# EasyEDA schematic SCH_Potentiometer_Led_MCP3008_2025-04-22.json
TITLE: Sheet_1; REV: 1.0; Date: 2025-04-22; Sheet: 1/1; Drawn By: dgasparyan073; Company: Your Company
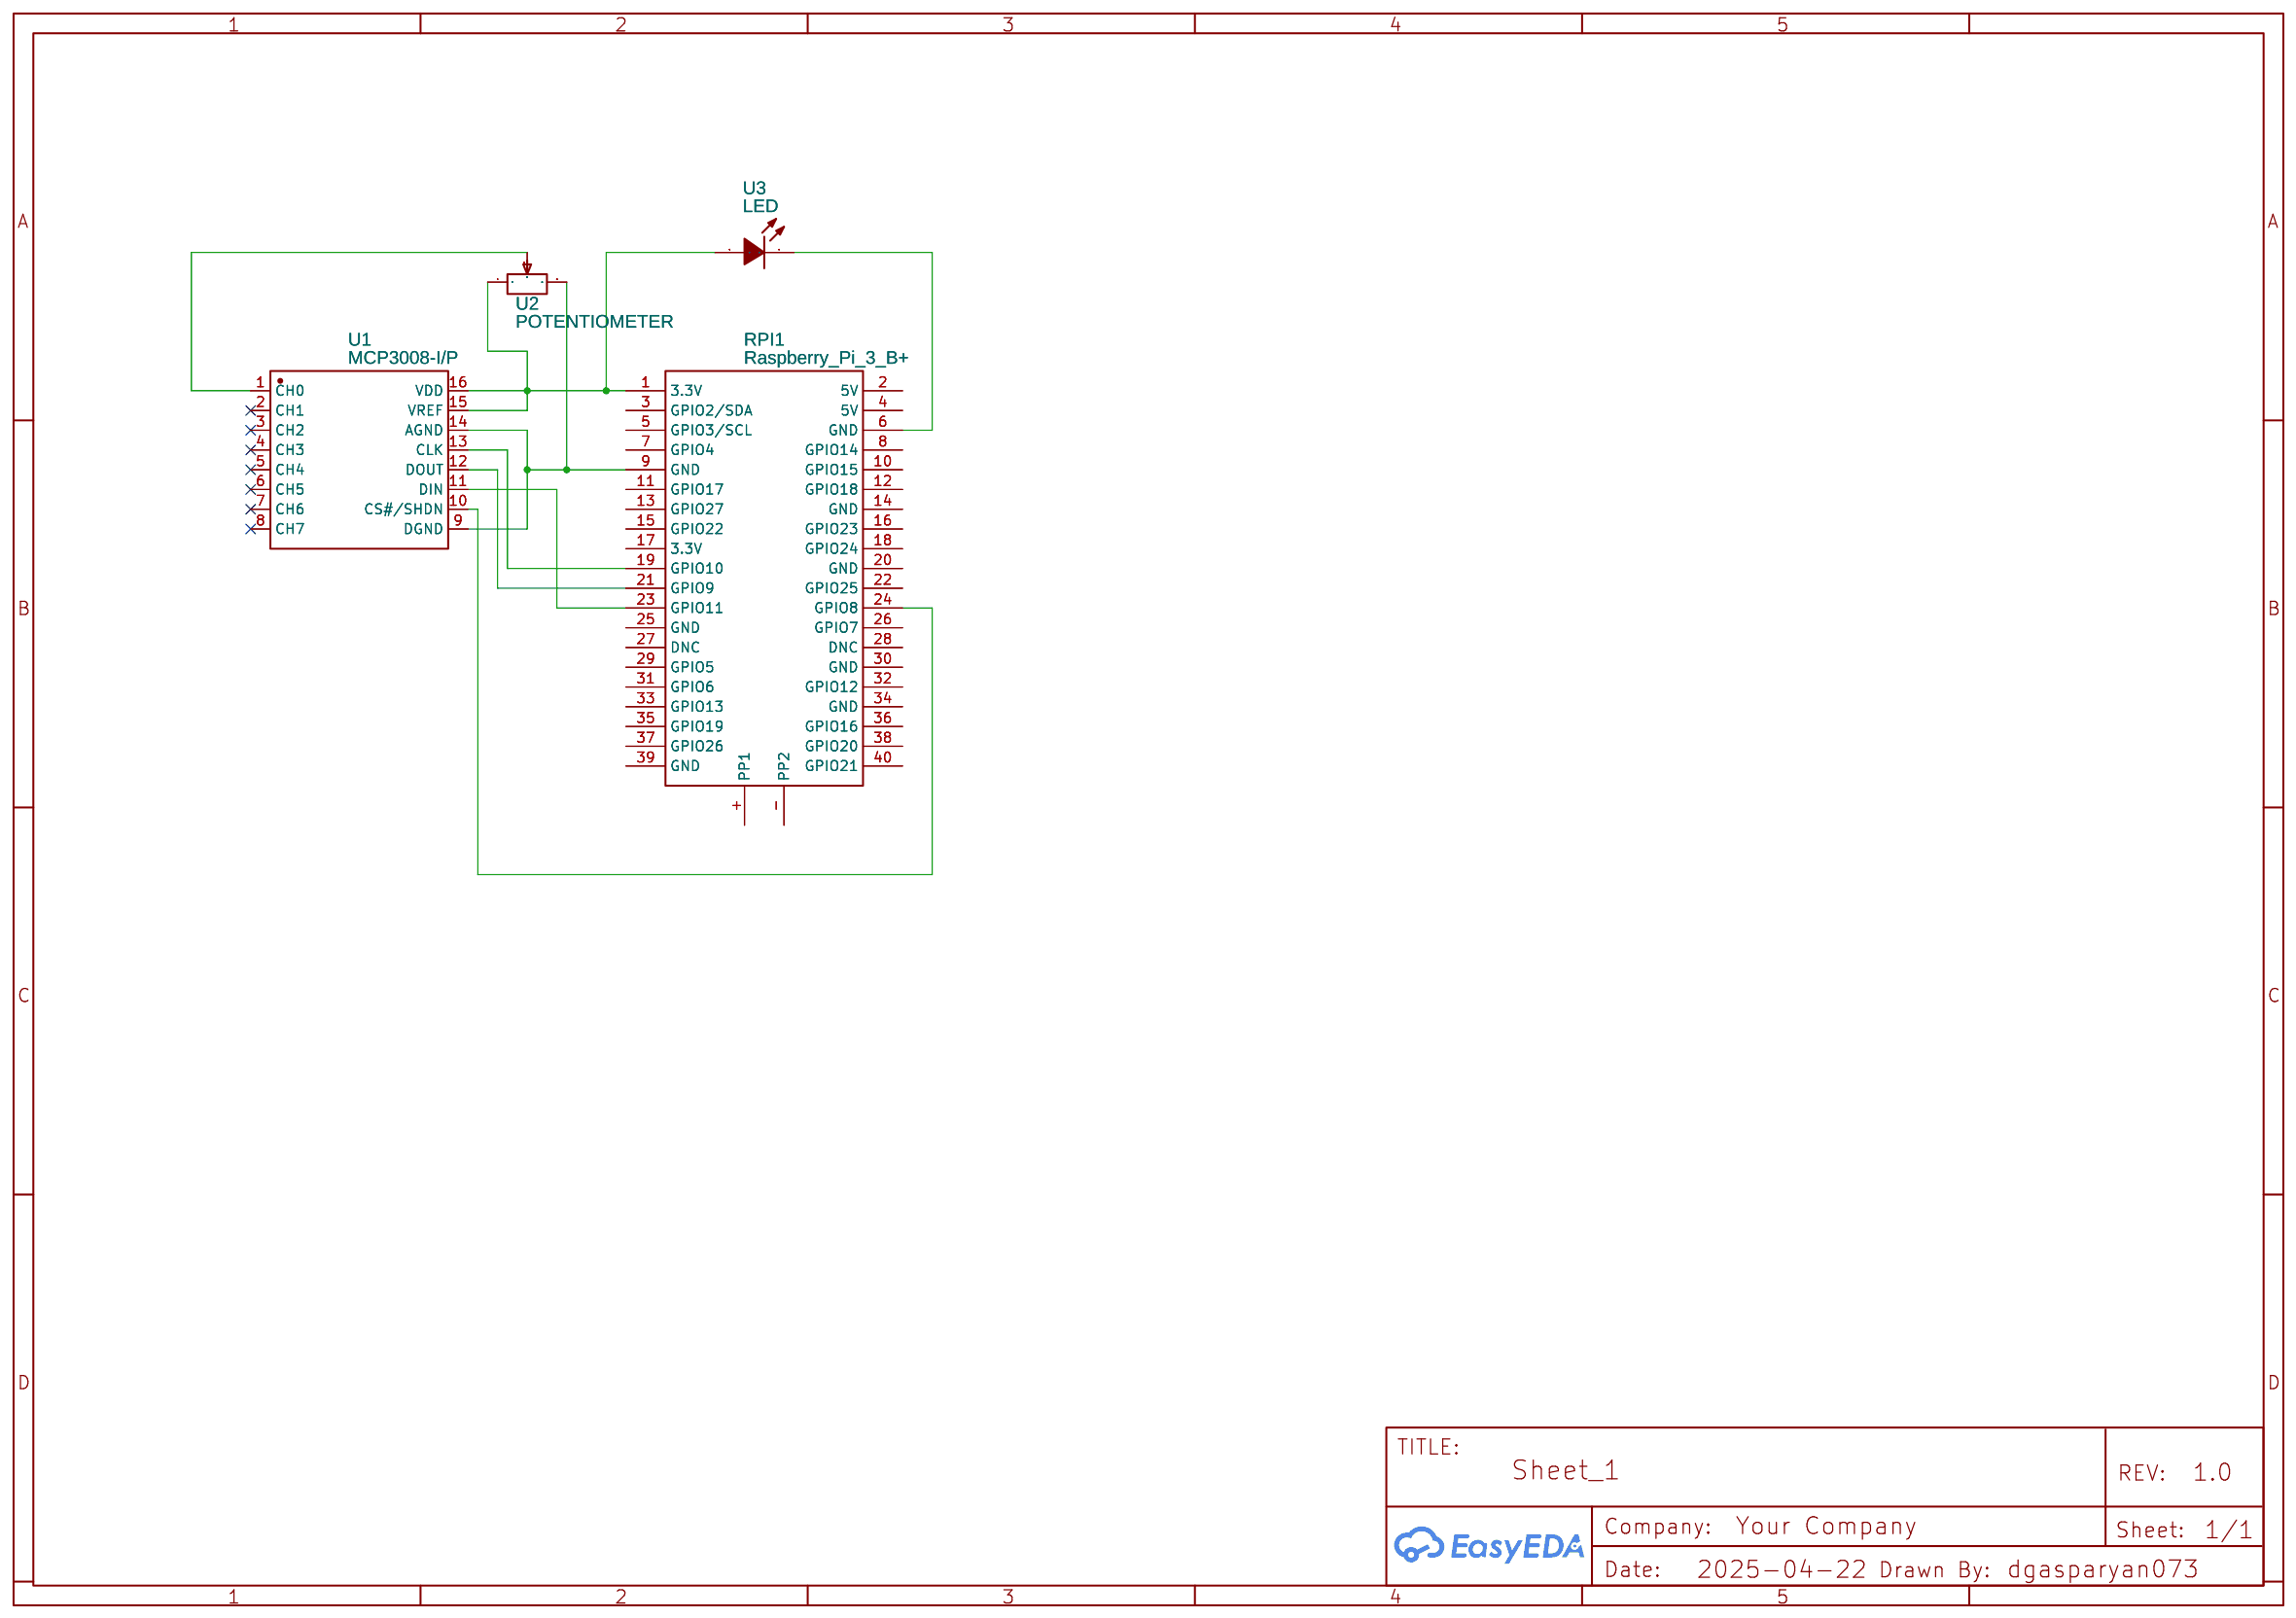
[diagram p0: schematic sheet]

## Parts
RPI1  Raspberry_Pi_3_B+  [HDR-20X2/2.54]
U1  MCP3008-I/P  [PDIP-16_L19.3-W6.5-P2.54-LS7.6-BL]
U2  POTENTIOMETER  [RES-ADJ-SMD_VG039NCH]
U3  LED  [LED-SMD_SD65-120-LED]

## Library data of the parts
RPI1 = Raspberry_Pi_3_B+: Contributor: Christopher; Supplier: Adafruit; Manufacturer: Raspberry Pi; Supplier Part: 3775; Manufacturer Part: Raspberry Pi 3 - Model B+ - 1.4GHz Cortex-A53 with 1GB RAM
U1 = MCP3008-I/P: Contributor: LCSC; Supplier: LCSC; Supplier Part: C2890491; Manufacturer: MICROCHIP(美国微芯); JLCPCB Part Class: Extended Part
U2 = 3*3POTENTIOMETER-10KΩ20%: Contributor: LCSC; Supplier: LCSC; Supplier Part: C9900010776; Manufacturer: null; Manufacturer Part: 3*3Potentiometer-10kΩ20%; JLCPCB Part Class: Extended Part
U3 = 720-LCGH9RNMXNX1: Contributor: lcsc; Supplier: LCSC; Supplier Part: C9900019959; Manufacturer: null; JLCPCB Part Class: Extended Part

## Nets
Net-(RPI1-1): RPI1.1(3.3V) U1.15(VREF) U1.16(VDD) U2.1 U3.2(A)
Net-(RPI1-6): RPI1.6(GND) U3.1(K)
Net-(RPI1-9): RPI1.9(GND) U1.9(DGND) U1.14(AGND) U2.3
Net-(RPI1-19): RPI1.19(GPIO10) U1.13(CLK)
Net-(RPI1-21): RPI1.21(GPIO9) U1.12(DOUT)
Net-(RPI1-23): RPI1.23(GPIO11) U1.11(DIN)
Net-(RPI1-24): RPI1.24(GPIO8) U1.10(CS#/SHDN)
Net-(U1-1): U1.1(CH0) U2.2

Not connected (* = marked no-connect by the designer): RPI1 2(5V) 3(GPIO2/SDA) 4(5V) 5(GPIO3/SCL) 7(GPIO4) 8(GPIO14) 10(GPIO15) 11(GPIO17) 12(GPIO18) 13(GPIO27) 14(GND) 15(GPIO22) 16(GPIO23) 17(3.3V) 18(GPIO24) 20(GND) 22(GPIO25) 25(GND) 26(GPIO7) 27(DNC) 28(DNC) 29(GPIO5) 30(GND) 31(GPIO6) 32(GPIO12) 33(GPIO13) 34(GND) 35(GPIO19) 36(GPIO16) 37(GPIO26) 38(GPIO20) 39(GND) 40(GPIO21) +(PP1) -(PP2); U1 2(CH1)* 3(CH2)* 4(CH3)* 5(CH4)* 6(CH5)* 7(CH6)* 8(CH7)*
